# Altium schematic sheet 24V_Main_Regulator.SchDoc (part 3 of 5)
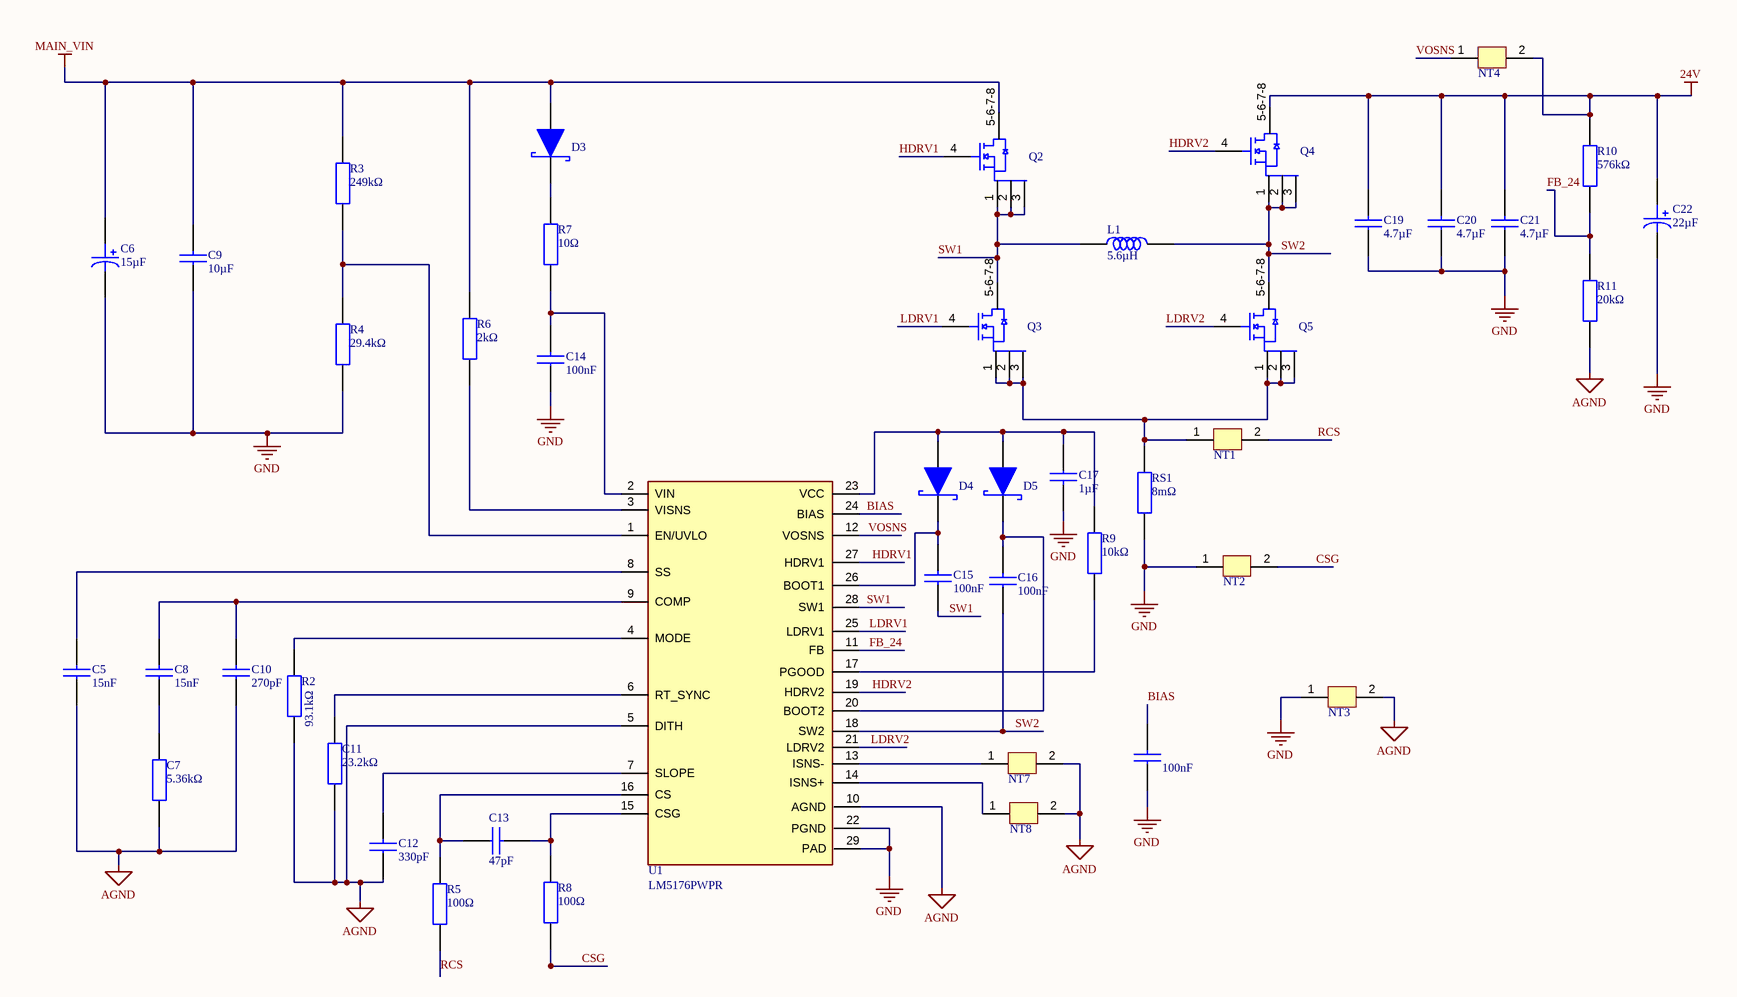
[diagram p2: 24V_Main_Regulator.SchDoc]

## Library data of the parts (continued)
C14 = CC0603KRX7R9BB104: Multilayer Ceramic Capacitor, CC Series, 0.1 - F, - 10%, X7R, 50 V, 0603 [1608 Metric]; Manufacturer: Yageo Group; Voltage: 50V; Supplier: Farnell; Supplier Part Number: CC0603KRX7R9BB104; Manufacturer Part Number: CC0603KRX7R9BB104; RoHS: Compliant; Category: Ceramic Capacitors; Stock: 1056568; Pricing: 10=0,0259, 100=0,0121, 500=0,0113, 1000=0,0104, 2000=0,0089, 4000=0,0073 (EUR); Case/Package: 0603; Case Code (Imperial): 0603; Case Code (Metric): 1608; China RoHS: Compliant; Country of Origin: Mainland China, Taiwan; Depth: 800µm; Dielectric: X7R; Dielectric Material: Ceramic; Export Control Classification Number (ECCN) Code: EAR99; Halogen Free: Halogen Free; Height: 800µm; Harmonized Tariff Schedule (HTS) Code: 8532.24.00.20; Introduction Date: 2005-08-18; Lead Free: Lead Free; Length: 1.6mm; Lifecycle Status: Production; Material: Ceramic; Max Operating Temperature: 125°C; Min Operating Temperature: -55°C; Mounting Technology: Surface Mount; Pins: 2; Number of Terminals: 2; Radiation Hardening: No; REACH SVHC: Yes; Schedule B: 8532240020, 8532240020|8532240020, 8532240020|8532240020|8532240020, 8532240020|8532240020|8532240020|8532240020; Termination: SMD/SMT; Thickness: 889µm; Tolerance: 10%; Voltage Rating: 50V; Voltage Rating (DC): 50V; Width: 800µm; ComponentLink1URL: https://datasheet.octopart.com:443/CC0603KRX7R9BB104-Yageo-datasheet-177165144.pdf?src-supplier=IHS; ComponentLink1Description: https://datasheet.octopart.com:443/CC0603KRX7R9BB104-Yageo-datasheet-177165144.pdf?src-supplier=IHS; ComponentLink2URL: https://datasheet.octopart.com:443/CC0603KRX7R9BB104-Yageo-datasheet-82288757.pdf?src-supplier=Upverter; ComponentLink2Description: https://datasheet.octopart.com:443/CC0603KRX7R9BB104-Yageo-datasheet-82288757.pdf?src-supplier=Upverter; ComponentLink3URL: https://datasheet.octopart.com:443/CC0603KRX7R9BB104-Yageo-datasheet-68298032.pdf?src-supplier=Upverter; ComponentLink3Description: https://datasheet.octopart.com:443/CC0603KRX7R9BB104-Yageo-datasheet-68298032.pdf?src-supplier=Upverter; ComponentLink4URL: https://datasheet.octopart.com:443/CC0603KRX7R9BB104-Yageo-Group-datasheet-189192896.pdf?src-supplier=Future+Electronics; ComponentLink4Description: https://datasheet.octopart.com:443/CC0603KRX7R9BB104-Yageo-Group-datasheet-189192896.pdf?src-supplier=Future+Electronics; ComponentLink5URL: https://datasheet.octopart.com:443/CC0603KRX7R9BB104-Yageo-datasheet-12526321.pdf?src-supplier=Future+Electronics; ComponentLink5Description: https://datasheet.octopart.com:443/CC0603KRX7R9BB104-Yageo-datasheet-12526321.pdf?src-supplier=Future+Electronics; ComponentLink6URL: https://datasheet.octopart.com:443/CC0603KRX7R9BB104-Yageo-datasheet-166511530.pdf?src-supplier=Future+Electronics; ComponentLink6Description: https://datasheet.octopart.com:443/CC0603KRX7R9BB104-Yageo-datasheet-166511530.pdf?src-supplier=Future+Electronics; ComponentLink7URL: https://datasheet.octopart.com:443/CC0603KRX7R9BB104-Yageo-datasheet-137700082.pdf?src-supplier=Future+Electronics; ComponentLink7Description: https://datasheet.octopart.com:443/CC0603KRX7R9BB104-Yageo-datasheet-137700082.pdf?src-supplier=Future+Electronics; ComponentLink8URL: https://datasheet.octopart.com:443/CC0603KRX7R9BB104-Yageo-datasheet-137700084.pdf?src-supplier=Future+Electronics; ComponentLink8Description: https://datasheet.octopart.com:443/CC0603KRX7R9BB104-Yageo-datasheet-137700084.pdf?src-supplier=Future+Electronics; ComponentLink9URL: https://datasheet.octopart.com:443/CC0603KRX7R9BB104-Yageo-datasheet-27626582.pdf?src-supplier=Future+Electronics; ComponentLink9Description: https://datasheet.octopart.com:443/CC0603KRX7R9BB104-Yageo-datasheet-27626582.pdf?src-supplier=Future+Electronics; ComponentLink10URL: https://datasheet.octopart.com:443/CC0603KRX7R9BB104-Yageo-datasheet-15895757.pdf?src-supplier=Future+Electronics; ComponentLink10Description: https://datasheet.octopart.com:443/CC0603KRX7R9BB104-Yageo-datasheet-15895757.pdf?src-supplier=Future+Electronics; ComponentLink11URL: https://datasheet.octopart.com:443/CC0603KRX7R9BB104-Yageo-datasheet-8324192.pdf?src-supplier=Future+Electronics; ComponentLink11Description: https://datasheet.octopart.com:443/CC0603KRX7R9BB104-Yageo-datasheet-8324192.pdf?src-supplier=Future+Electronics; ComponentLink12URL: https://datasheet.octopart.com/CC0603KRX7R9BB104-Yageo-datasheet-10883670.pdf; ComponentLink12Description: https://datasheet.octopart.com/CC0603KRX7R9BB104-Yageo-datasheet-10883670.pdf; ComponentLink13URL: https://datasheet.octopart.com:443/CC0603KRX7R9BB104-Yageo-datasheet-181968726.pdf?src-supplier=Newark; ComponentLink13Description: https://datasheet.octopart.com:443/CC0603KRX7R9BB104-Yageo-datasheet-181968726.pdf?src-supplier=Newark; ComponentLink14URL: https://datasheet.octopart.com:443/CC0603KRX7R9BB104-Yageo-datasheet-499490.pdf?src-supplier=Newark; ComponentLink14Description: https://datasheet.octopart.com:443/CC0603KRX7R9BB104-Yageo-datasheet-499490.pdf?src-supplier=Newark; ComponentLink15URL: https://datasheet.octopart.com:443/CC0603KRX7R9BB104-Yageo-datasheet-62336348.pdf?src-supplier=Newark; ComponentLink15Description: https://datasheet.octopart.com:443/CC0603KRX7R9BB104-Yageo-datasheet-62336348.pdf?src-supplier=Newark; ComponentLink16URL: https://datasheet.octopart.com:443/CC0603KRX7R9BB104-Yageo-datasheet-147453679.pdf?src-supplier=Newark; ComponentLink16Description: https://datasheet.octopart.com:443/CC0603KRX7R9BB104-Yageo-datasheet-147453679.pdf?src-supplier=Newark; ComponentLink17URL: https://datasheet.octopart.com:443/CC0603KRX7R9BB104-Yageo-datasheet-151948686.pdf?src-supplier=Farnell; ComponentLink17Description: https://datasheet.octopart.com:443/CC0603KRX7R9BB104-Yageo-datasheet-151948686.pdf?src-supplier=Farnell; ComponentLink18URL: https://datasheet.octopart.com:443/CC0603KRX7R9BB104-Yageo-datasheet-500777.pdf?src-supplier=Farnell; ComponentLink18Description: https://datasheet.octopart.com:443/CC0603KRX7R9BB104-Yageo-datasheet-500777.pdf?src-supplier=Farnell; ComponentLink19URL: https://datasheet.octopart.com:443/CC0603KRX7R9BB104-Yageo-datasheet-178019014.pdf?src-supplier=Burklin+Elektronik; ComponentLink19Description: https://datasheet.octopart.com:443/CC0603KRX7R9BB104-Yageo-datasheet-178019014.pdf?src-supplier=Burklin+Elektronik; ComponentLink20URL: https://datasheet.octopart.com:443/CC0603KRX7R9BB104-Yageo-Group-datasheet-165992755.pdf?src-supplier=ODG+(Origin+Data+Global); ComponentLink20Description: https://datasheet.octopart.com:443/CC0603KRX7R9BB104-Yageo-Group-datasheet-165992755.pdf?src-supplier=ODG+(Origin+Data+Global); ComponentLink21URL: https://datasheet.octopart.com:443/CC0603KRX7R9BB104-Yageo-datasheet-140260305.pdf?src-supplier=SOS+electronic; ComponentLink21Description: https://datasheet.octopart.com:443/CC0603KRX7R9BB104-Yageo-datasheet-140260305.pdf?src-supplier=SOS+electronic; ComponentLink22URL: https://datasheet.octopart.com:443/CC0603KRX7R9BB104-Yageo-datasheet-120101875.pdf?src-supplier=Megastar; ComponentLink22Description: https://datasheet.octopart.com:443/CC0603KRX7R9BB104-Yageo-datasheet-120101875.pdf?src-supplier=Megastar; ComponentLink23URL: https://datasheet.octopart.com:443/CC0603KRX7R9BB104-Yageo-datasheet-8701427.pdf?src-supplier=element14; ComponentLink23Description: https://datasheet.octopart.com:443/CC0603KRX7R9BB104-Yageo-datasheet-8701427.pdf?src-supplier=element14; ComponentLink24URL: https://datasheet.octopart.com:443/CC0603KRX7R9BB104-Yageo-datasheet-5301394.pdf?src-supplier=element14; ComponentLink24Description: https://datasheet.octopart.com:443/CC0603KRX7R9BB104-Yageo-datasheet-5301394.pdf?src-supplier=element14; ComponentLink25URL: https://datasheet.octopart.com:443/CC0603KRX7R9BB104-Yageo-datasheet-17600895.pdf?src-supplier=TME; ComponentLink25Description: https://datasheet.octopart.com:443/CC0603KRX7R9BB104-Yageo-datasheet-17600895.pdf?src-supplier=TME; ComponentLink26URL: http://sigma.octopart.com:80/15889575/rohs_statement/Yageo-CC0603KRX7R9BB104.pdf?src-supplier=Compliance+Statements; ComponentLink26Description: http://sigma.octopart.com:80/15889575/rohs_statement/Yageo-CC0603KRX7R9BB104.pdf?src-supplier=Compliance+Statements; ComponentLink27URL: http://sigma.octopart.com:80/conflict_mineral_statement/Yageo-company-3.pdf?src-supplier=Compliance+Statements; ComponentLink27Description: http://sigma.octopart.com:80/conflict_mineral_statement/Yageo-company-3.pdf?src-supplier=Compliance+Statements
C15 C16 = 06033C104KAT2A: 0603 100 nF 25 V ±10% Tolerance X7R Surface Mount Multilayer Ceramic Capacitor; Manufacturer: KYOCERA AVX; Voltage: 25V; Supplier: Future Electronics; Supplier Part Number: 06033C104KAT2A; Manufacturer Part Number: 06033C104KAT2A; RoHS: Compliant; Category: Ceramic Capacitors; Stock: 264000; Pricing: 8000=0,0028, 40000=0,0027, 100000=0,0026, 300000=0,0026, 600000=0,0024 (USD); Case/Package: 0603; Case Code (Imperial): 0603; Case Code (Metric): 1608; China RoHS: Compliant; Contact Plating: Tin; Country of Origin: Mainland China, Taiwan; Depth: 810µm; Dielectric: X7R; Dielectric Material: Ceramic; Export Control Classification Number (ECCN) Code: EAR99; Height: 900µm; Harmonized Tariff Schedule (HTS) Code: 8532.24.00.20; Introduction Date: 2003-10-30; Lead Free: Lead Free; Length: 1.6mm; Lifecycle Status: Production; Material: Ceramic; Max Operating Temperature: 125°C; Min Operating Temperature: -55°C; Mounting Technology: Surface Mount; Pins: 2; Number of Terminals: 2; Packaging: Cut Tape; Radiation Hardening: No; REACH SVHC: Yes; Schedule B: 8532240020; Termination: SMD/SMT; Thickness: 889µm; Tolerance: 10%; Voltage Rating: 25V; Voltage Rating (DC): 25V; Width: 810µm; ComponentLink1URL: https://datasheet.octopart.com:443/06033C104KAT2A-KYOCERA-AVX-datasheet-170560559.pdf?src-supplier=IHS; ComponentLink1Description: https://datasheet.octopart.com:443/06033C104KAT2A-KYOCERA-AVX-datasheet-170560559.pdf?src-supplier=IHS; ComponentLink2URL: https://datasheet.octopart.com:443/06033C104KAT2A-KYOCERA-AVX-datasheet-50865067.pdf?src-supplier=Upverter; ComponentLink2Description: https://datasheet.octopart.com:443/06033C104KAT2A-KYOCERA-AVX-datasheet-50865067.pdf?src-supplier=Upverter; ComponentLink3URL: https://sigma.octopart.com:443/147443767/technical_drawing/AVX-06033C104KAT2A.pdf?src-supplier=Upverter; ComponentLink3Description: https://sigma.octopart.com:443/147443767/technical_drawing/AVX-06033C104KAT2A.pdf?src-supplier=Upverter; ComponentLink4URL: https://datasheet.octopart.com:443/06033C104KAT2A-KYOCERA-AVX-datasheet-12587061.pdf?src-supplier=Newark; ComponentLink4Description: https://datasheet.octopart.com:443/06033C104KAT2A-KYOCERA-AVX-datasheet-12587061.pdf?src-supplier=Newark; ComponentLink5URL: https://datasheet.octopart.com:443/06033C104KAT2A-KYOCERA-AVX-datasheet-158983632.pdf?src-supplier=Newark; ComponentLink5Description: https://datasheet.octopart.com:443/06033C104KAT2A-KYOCERA-AVX-datasheet-158983632.pdf?src-supplier=Newark; ComponentLink6URL: https://datasheet.octopart.com:443/06033C104KAT2A-AVX-datasheet-12509786.pdf?src-supplier=Farnell; ComponentLink6Description: https://datasheet.octopart.com:443/06033C104KAT2A-AVX-datasheet-12509786.pdf?src-supplier=Farnell; ComponentLink7URL: https://datasheet.octopart.com:443/06033C104KAT2A-AVX-datasheet-8113618.pdf?src-supplier=Future+Electronics; ComponentLink7Description: https://datasheet.octopart.com:443/06033C104KAT2A-AVX-datasheet-8113618.pdf?src-supplier=Future+Electronics; ComponentLink8URL: https://datasheet.octopart.com:443/06033C104KAT2A-AVX-datasheet-5313617.pdf?src-supplier=Future+Electronics; ComponentLink8Description: https://datasheet.octopart.com:443/06033C104KAT2A-AVX-datasheet-5313617.pdf?src-supplier=Future+Electronics; ComponentLink9URL: https://datasheet.octopart.com:443/06033C104KAT2A-AVX-datasheet-167033.pdf?src-supplier=Future+Electronics; ComponentLink9Description: https://datasheet.octopart.com:443/06033C104KAT2A-AVX-datasheet-167033.pdf?src-supplier=Future+Electronics; ComponentLink10URL: https://datasheet.octopart.com:443/06033C104KAT2A-AVX-datasheet-78690206.pdf?src-supplier=element14+APAC; ComponentLink10Description: https://datasheet.octopart.com:443/06033C104KAT2A-AVX-datasheet-78690206.pdf?src-supplier=element14+APAC; ComponentLink11URL: https://datasheet.octopart.com:443/06033C104KAT2A-KYOCERA-AVX-datasheet-65931687.pdf?src-supplier=element14+APAC; ComponentLink11Description: https://datasheet.octopart.com:443/06033C104KAT2A-KYOCERA-AVX-datasheet-65931687.pdf?src-supplier=element14+APAC; ComponentLink12URL: https://datasheet.octopart.com:443/06033C104KAT2A-AVX-datasheet-26446220.pdf?src-supplier=element14+APAC; ComponentLink12Description: https://datasheet.octopart.com:443/06033C104KAT2A-AVX-datasheet-26446220.pdf?src-supplier=element14+APAC; ComponentLink13URL: https://datasheet.octopart.com:443/06033C104KAT2A-AVX---Kyocera-datasheet-8446237.pdf?src-supplier=TME; ComponentLink13Description: https://datasheet.octopart.com:443/06033C104KAT2A-AVX---Kyocera-datasheet-8446237.pdf?src-supplier=TME; ComponentLink14URL: https://datasheet.octopart.com:443/06033C104KAT2A-KYOCERA-AVX-datasheet-156093841.pdf?src-supplier=TME; ComponentLink14Description: https://datasheet.octopart.com:443/06033C104KAT2A-KYOCERA-AVX-datasheet-156093841.pdf?src-supplier=TME; ComponentLink15URL: https://datasheet.octopart.com:443/06033C104KAT2A-AVX-datasheet-166051239.pdf?src-supplier=Amar+Radio+Corporation; ComponentLink15Description: https://datasheet.octopart.com:443/06033C104KAT2A-AVX-datasheet-166051239.pdf?src-supplier=Amar+Radio+Corporation; ComponentLink16URL: https://datasheet.octopart.com/06033C104KAT2A-AVX---Kyocera-datasheet-13516023.pdf; ComponentLink16Description: https://datasheet.octopart.com/06033C104KAT2A-AVX---Kyocera-datasheet-13516023.pdf; ComponentLink17URL: https://datasheet.octopart.com/Commercial-Surface-Mount-Chips---X7R-Dielectric-AVX-datasheet-family-100.pdf; ComponentLink17Description: https://datasheet.octopart.com/Commercial-Surface-Mount-Chips---X7R-Dielectric-AVX-datasheet-family-100.pdf; ComponentLink18URL: https://datasheet.octopart.com:443/06033C104KAT2A-AVX-datasheet-11546901.pdf?src-supplier=Arrow+Electronics; ComponentLink18Description: https://datasheet.octopart.com:443/06033C104KAT2A-AVX-datasheet-11546901.pdf?src-supplier=Arrow+Electronics; ComponentLink19URL: https://datasheet.octopart.com:443/06033C104KAT2A-AVX-datasheet-8316804.pdf?src-supplier=Garrett; ComponentLink19Description: https://datasheet.octopart.com:443/06033C104KAT2A-AVX-datasheet-8316804.pdf?src-supplier=Garrett; ComponentLink20URL: https://datasheet.octopart.com:443/06033C104KAT2A-AVX-datasheet-5383.pdf?src-supplier=Garrett; ComponentLink20Description: https://datasheet.octopart.com:443/06033C104KAT2A-AVX-datasheet-5383.pdf?src-supplier=Garrett; ComponentLink21URL: https://datasheet.octopart.com:443/06033C104KAT2A-AVX-datasheet-148183.pdf?src-supplier=Garrett; ComponentLink21Description: https://datasheet.octopart.com:443/06033C104KAT2A-AVX-datasheet-148183.pdf?src-supplier=Garrett; ComponentLink22URL: https://datasheet.octopart.com:443/06033C104KAT2A-AVX-datasheet-7276737.pdf?src-supplier=Jameco; ComponentLink22Description: https://datasheet.octopart.com:443/06033C104KAT2A-AVX-datasheet-7276737.pdf?src-supplier=Jameco; ComponentLink23URL: https://datasheet.octopart.com:443/06033C104KAT2A-AVX-datasheet-119053.pdf?src-supplier=DigiKey; ComponentLink23Description: https://datasheet.octopart.com:443/06033C104KAT2A-AVX-datasheet-119053.pdf?src-supplier=DigiKey; ComponentLink24URL: https://datasheet.octopart.com:443/06033C104KAT2A-AVX-datasheet-4352.pdf?src-supplier=RS+(Formerly+Allied+Electronics); ComponentLink24Description: https://datasheet.octopart.com:443/06033C104KAT2A-AVX-datasheet-4352.pdf?src-supplier=RS+(Formerly+Allied+Electronics); ComponentLink25URL: http://sigma.octopart.com:80/conflict_mineral_statement/AVX-company-34.pdf?src-supplier=Compliance+Statements; ComponentLink25Description: http://sigma.octopart.com:80/conflict_mineral_statement/AVX-company-34.pdf?src-supplier=Compliance+Statements; ComponentLink26URL: http://sigma.octopart.com:80/reach_statement/AVX-company-19.pdf?src-supplier=Compliance+Statements; ComponentLink26Description: http://sigma.octopart.com:80/reach_statement/AVX-company-19.pdf?src-supplier=Compliance+Statements
C17 = EMK107B7105KA-T: 16V 1uF X7R ±10% 0603 Multilayer Ceramic Capacitors MLCC - SMD/SMT ROHS; Manufacturer: TAIYO YUDEN; Supplier: Avnet; Supplier Part Number: EMK107B7105KA-T; Manufacturer Part Number: EMK107B7105KA-T; RoHS: Compliant; Category: Ceramic Capacitors; Stock: 1408000; Pricing: 4000=0,00792 (USD); Case/Package: 0603; Case Code (Imperial): 0603; Case Code (Metric): 1608; China RoHS: Compliant; Composition: Ceramic; Contact Plating: Nickel; Country of Origin: Japan, Mainland China, Malaysia, South Korea; Depth: 800µm; Dielectric: X7R; Dielectric Material: Ceramic; Export Control Classification Number (ECCN) Code: EAR99; Halogen Free: Halogen Free; Height: 800µm; Harmonized Tariff Schedule (HTS) Code: 8532.24.00.20; Introduction Date: 2007-09-13; Lead Free: Lead Free; Length: 1.6mm; Lifecycle Status: Production; Material: Ceramic; Max Length: 1.7mm; Max Operating Temperature: 125°C; Max Thickness: 900µm; Max Width: 900µm; Min Length: 1.5mm; Min Operating Temperature: -55°C; Min Thickness: 700µm; Min Width: 700µm; Mounting Technology: Surface Mount; Pins: 2; Number of Terminals: 2; Packaging: Cut Tape; Radiation Hardening: No; REACH SVHC: Yes; Termination: SMD/SMT; Thickness: 889µm; Tolerance: 10%; Voltage Rating: 16V; Voltage Rating (DC): 16V; Width: 800µm; ComponentLink1URL: https://datasheet.octopart.com:443/EMK107B7105KA-T-Taiyo-Yuden-datasheet-182102775.pdf?src-supplier=IHS; ComponentLink1Description: https://datasheet.octopart.com:443/EMK107B7105KA-T-Taiyo-Yuden-datasheet-182102775.pdf?src-supplier=IHS; ComponentLink2URL: https://datasheet.octopart.com:443/EMK107B7105KA-T-Taiyo-Yuden-datasheet-8857305.pdf?src-supplier=Master+Electronics; ComponentLink2Description: https://datasheet.octopart.com:443/EMK107B7105KA-T-Taiyo-Yuden-datasheet-8857305.pdf?src-supplier=Master+Electronics; ComponentLink3URL: https://datasheet.octopart.com:443/EMK107B7105KA-T-Taiyo-Yuden-datasheet-154807686.pdf?src-supplier=Master+Electronics; ComponentLink3Description: https://datasheet.octopart.com:443/EMK107B7105KA-T-Taiyo-Yuden-datasheet-154807686.pdf?src-supplier=Master+Electronics; ComponentLink4URL: https://datasheet.octopart.com:443/EMK107B7105KA-T-Taiyo-Yuden-datasheet-140424376.pdf?src-supplier=Master+Electronics; ComponentLink4Description: https://datasheet.octopart.com:443/EMK107B7105KA-T-Taiyo-Yuden-datasheet-140424376.pdf?src-supplier=Master+Electronics; ComponentLink5URL: https://datasheet.octopart.com:443/EMK107B7105KA-T-Taiyo-Yuden-datasheet-151625811.pdf?src-supplier=Farnell; ComponentLink5Description: https://datasheet.octopart.com:443/EMK107B7105KA-T-Taiyo-Yuden-datasheet-151625811.pdf?src-supplier=Farnell; ComponentLink6URL: https://datasheet.octopart.com:443/EMK107B7105KA-T-Taiyo-Yuden-datasheet-65850851.pdf?src-supplier=Newark; ComponentLink6Description: https://datasheet.octopart.com:443/EMK107B7105KA-T-Taiyo-Yuden-datasheet-65850851.pdf?src-supplier=Newark; ComponentLink7URL: https://datasheet.octopart.com:443/EMK107B7105KA-T-Taiyo-Yuden-datasheet-14717454.pdf?src-supplier=Newark; ComponentLink7Description: https://datasheet.octopart.com:443/EMK107B7105KA-T-Taiyo-Yuden-datasheet-14717454.pdf?src-supplier=Newark; ComponentLink8URL: https://datasheet.octopart.com:443/EMK107B7105KA-T-Taiyo-Yuden-datasheet-138738940.pdf?src-supplier=Taiyo+Yuden+SCT; ComponentLink8Description: https://datasheet.octopart.com:443/EMK107B7105KA-T-Taiyo-Yuden-datasheet-138738940.pdf?src-supplier=Taiyo+Yuden+SCT; ComponentLink9URL: https://datasheet.octopart.com:443/EMK107B7105KA-T-Taiyo-Yuden-datasheet-99784766.pdf?src-supplier=Future+Electronics; ComponentLink9Description: https://datasheet.octopart.com:443/EMK107B7105KA-T-Taiyo-Yuden-datasheet-99784766.pdf?src-supplier=Future+Electronics; ComponentLink10URL: https://datasheet.octopart.com:443/EMK107B7105KA-T-Taiyo-Yuden-datasheet-99833418.pdf?src-supplier=Future+Electronics; ComponentLink10Description: https://datasheet.octopart.com:443/EMK107B7105KA-T-Taiyo-Yuden-datasheet-99833418.pdf?src-supplier=Future+Electronics; ComponentLink11URL: https://datasheet.octopart.com:443/CEEMK107B7105KA-T-Taiyo-Yuden-datasheet-62282700.pdf?src-supplier=Electro+Sonic; ComponentLink11Description: https://datasheet.octopart.com:443/CEEMK107B7105KA-T-Taiyo-Yuden-datasheet-62282700.pdf?src-supplier=Electro+Sonic; ComponentLink12URL: https://datasheet.octopart.com:443/EMK107B7105KA-T-Taiyo-Yuden-datasheet-62109223.pdf?src-supplier=Electro+Sonic; ComponentLink12Description: https://datasheet.octopart.com:443/EMK107B7105KA-T-Taiyo-Yuden-datasheet-62109223.pdf?src-supplier=Electro+Sonic; ComponentLink13URL: https://datasheet.octopart.com:443/EMK107B7105KA-T-Taiyo-Yuden-datasheet-41181424.pdf?src-supplier=Electro+Sonic; ComponentLink13Description: https://datasheet.octopart.com:443/EMK107B7105KA-T-Taiyo-Yuden-datasheet-41181424.pdf?src-supplier=Electro+Sonic; ComponentLink14URL: https://datasheet.octopart.com/EMK107B7105KA-T-Taiyo-Yuden-datasheet-17272276.pdf; ComponentLink14Description: https://datasheet.octopart.com/EMK107B7105KA-T-Taiyo-Yuden-datasheet-17272276.pdf; ComponentLink15URL: https://datasheet.octopart.com:443/EMK107B7105KA-T-Taiyo-Yuden-datasheet-13693549.pdf?src-supplier=_legacy+Avnet; ComponentLink15Description: https://datasheet.octopart.com:443/EMK107B7105KA-T-Taiyo-Yuden-datasheet-13693549.pdf?src-supplier=_legacy+Avnet; ComponentLink16URL: https://datasheet.octopart.com:443/EMK107B7105KA-T-Taiyo-Yuden-datasheet-10851928.pdf?src-supplier=element14; ComponentLink16Description: https://datasheet.octopart.com:443/EMK107B7105KA-T-Taiyo-Yuden-datasheet-10851928.pdf?src-supplier=element14; ComponentLink17URL: https://datasheet.octopart.com:443/EMK107B7105KA-T-Taiyo-Yuden-datasheet-8434558.pdf?src-supplier=element14; ComponentLink17Description: https://datasheet.octopart.com:443/EMK107B7105KA-T-Taiyo-Yuden-datasheet-8434558.pdf?src-supplier=element14; ComponentLink18URL: https://datasheet.octopart.com:443/EMK107B7105KA-T-Taiyo-Yuden-datasheet-10742123.pdf?src-supplier=Factory+Futures; ComponentLink18Description: https://datasheet.octopart.com:443/EMK107B7105KA-T-Taiyo-Yuden-datasheet-10742123.pdf?src-supplier=Factory+Futures
C18 = C0805C104M5RACTU: 50V 100nF X7R ±20% 0805 Multilayer Ceramic Capacitors MLCC - SMD/SMT ROHS; Manufacturer: Yageo Group; Dissipation Factor: 2.5%; Temperature Coefficient: 30ppm/°C; Supplier: Farnell; Supplier Part Number: C0805C104M5RACTU; Manufacturer Part Number: C0805C104M5RACTU; RoHS: Compliant; Category: Ceramic Capacitors; Stock: 81750; Pricing: 10=0,0284, 100=0,0246, 500=0,0179, 1000=0,0161, 2000=0,0135 (EUR); Case/Package: 0805; Case Code (Imperial): 0805; China RoHS: Compliant; Country of Origin: Mexico; Depth: 1.25mm; Dielectric: X7R; Dielectric Material: Ceramic; Export Control Classification Number (ECCN) Code: EAR99; Height: 780µm; Harmonized Tariff Schedule (HTS) Code: 8532.24.00.20; Introduction Date: 2008-01-10; Lead Free: Lead Free; Length: 2mm; Lifecycle Status: Production; Material: Ceramic; Max Operating Temperature: 125°C; Min Operating Temperature: -55°C; Mounting Technology: Surface Mount; Pins: 2; Number of Terminals: 2; Packaging: Cut Tape; Radiation Hardening: No; REACH SVHC: Yes; Schedule B: 8532240020, 8532240020|8532240020, 8532240020|8532240020|8532240020, 8532240020|8532240020|8532240020|8532240020; Termination: SMD/SMT; Thickness: 889µm; Tolerance: 20%; Voltage: 50V; Voltage Rating: 50V; Voltage Rating (DC): 50V; Weight: 5.499807mg; Width: 1.25mm; ComponentLink1URL: https://datasheet.octopart.com:443/C0805C104M5RACTU-KEMET-datasheet-178445679.pdf?src-supplier=Farnell; ComponentLink1Description: https://datasheet.octopart.com:443/C0805C104M5RACTU-KEMET-datasheet-178445679.pdf?src-supplier=Farnell; ComponentLink2URL: https://datasheet.octopart.com:443/C0805C104M5RACTU-KEMET-datasheet-137357759.pdf?src-supplier=Farnell; ComponentLink2Description: https://datasheet.octopart.com:443/C0805C104M5RACTU-KEMET-datasheet-137357759.pdf?src-supplier=Farnell; ComponentLink3URL: https://datasheet.octopart.com:443/C0805C104M5RACTU-KEMET-datasheet-101576149.pdf?src-supplier=Farnell; ComponentLink3Description: https://datasheet.octopart.com:443/C0805C104M5RACTU-KEMET-datasheet-101576149.pdf?src-supplier=Farnell; ComponentLink4URL: https://datasheet.octopart.com:443/C0805C104M5RAC-TU-Kemet-datasheet-7833651.pdf?src-supplier=Farnell; ComponentLink4Description: https://datasheet.octopart.com:443/C0805C104M5RAC-TU-Kemet-datasheet-7833651.pdf?src-supplier=Farnell; ComponentLink5URL: https://datasheet.octopart.com:443/C0805C104M5RAC-TU-Kemet-datasheet-7601896.pdf?src-supplier=Farnell; ComponentLink5Description: https://datasheet.octopart.com:443/C0805C104M5RAC-TU-Kemet-datasheet-7601896.pdf?src-supplier=Farnell; ComponentLink6URL: https://datasheet.octopart.com:443/C0805C104M5RAC-TU-Kemet-datasheet-5316294.pdf?src-supplier=Farnell; ComponentLink6Description: https://datasheet.octopart.com:443/C0805C104M5RAC-TU-Kemet-datasheet-5316294.pdf?src-supplier=Farnell; ComponentLink7URL: https://datasheet.octopart.com:443/C0805C104M5RAC-TU-Kemet-datasheet-5314837.pdf?src-supplier=Farnell; ComponentLink7Description: https://datasheet.octopart.com:443/C0805C104M5RAC-TU-Kemet-datasheet-5314837.pdf?src-supplier=Farnell; ComponentLink8URL: https://datasheet.octopart.com:443/C0805C104M5RAC-TU-Kemet-datasheet-8092359.pdf?src-supplier=Farnell; ComponentLink8Description: https://datasheet.octopart.com:443/C0805C104M5RAC-TU-Kemet-datasheet-8092359.pdf?src-supplier=Farnell; ComponentLink9URL: https://datasheet.octopart.com:443/C0805C104M5RAC-TU-Kemet-datasheet-5314449.pdf?src-supplier=Farnell; ComponentLink9Description: https://datasheet.octopart.com:443/C0805C104M5RAC-TU-Kemet-datasheet-5314449.pdf?src-supplier=Farnell; ComponentLink10URL: https://datasheet.octopart.com:443/C0805C104M5RAC-TU-Kemet-datasheet-5314969.pdf?src-supplier=Farnell; ComponentLink10Description: https://datasheet.octopart.com:443/C0805C104M5RAC-TU-Kemet-datasheet-5314969.pdf?src-supplier=Farnell; ComponentLink11URL: https://datasheet.octopart.com:443/C0805C104M5RAC-TU-Kemet-datasheet-5314627.pdf?src-supplier=Farnell; ComponentLink11Description: https://datasheet.octopart.com:443/C0805C104M5RAC-TU-Kemet-datasheet-5314627.pdf?src-supplier=Farnell; ComponentLink12URL: https://datasheet.octopart.com:443/C0805C104M5RAC-TU-Kemet-datasheet-5389132.pdf?src-supplier=Farnell; ComponentLink12Description: https://datasheet.octopart.com:443/C0805C104M5RAC-TU-Kemet-datasheet-5389132.pdf?src-supplier=Farnell; ComponentLink13URL: https://datasheet.octopart.com:443/C0805C104M5RAC-TU-Kemet-datasheet-5313836.pdf?src-supplier=Farnell; ComponentLink13Description: https://datasheet.octopart.com:443/C0805C104M5RAC-TU-Kemet-datasheet-5313836.pdf?src-supplier=Farnell; ComponentLink14URL: https://datasheet.octopart.com:443/C0805C104M5RAC-TU-Kemet-datasheet-8111010.pdf?src-supplier=Farnell; ComponentLink14Description: https://datasheet.octopart.com:443/C0805C104M5RAC-TU-Kemet-datasheet-8111010.pdf?src-supplier=Farnell; ComponentLink15URL: https://datasheet.octopart.com:443/C0805C104M5RAC-TU-Kemet-datasheet-7627733.pdf?src-supplier=Farnell; ComponentLink15Description: https://datasheet.octopart.com:443/C0805C104M5RAC-TU-Kemet-datasheet-7627733.pdf?src-supplier=Farnell; ComponentLink16URL: https://datasheet.octopart.com:443/C0805C104M5RAC-TU-Kemet-datasheet-5315946.pdf?src-supplier=Farnell; ComponentLink16Description: https://datasheet.octopart.com:443/C0805C104M5RAC-TU-Kemet-datasheet-5315946.pdf?src-supplier=Farnell; ComponentLink17URL: https://datasheet.octopart.com:443/C0805C104M5RACTU-KEMET-datasheet-182041143.pdf?src-supplier=IHS; ComponentLink17Description: https://datasheet.octopart.com:443/C0805C104M5RACTU-KEMET-datasheet-182041143.pdf?src-supplier=IHS; ComponentLink18URL: https://datasheet.octopart.com:443/C0805C104M5RACTU-KEMET-datasheet-68331921.pdf?src-supplier=Upverter; ComponentLink18Description: https://datasheet.octopart.com:443/C0805C104M5RACTU-KEMET-datasheet-68331921.pdf?src-supplier=Upverter; ComponentLink19URL: https://datasheet.octopart.com:443/C0805C104M5RAC-TU-Kemet-datasheet-5313890.pdf?src-supplier=Newark; ComponentLink19Description: https://datasheet.octopart.com:443/C0805C104M5RAC-TU-Kemet-datasheet-5313890.pdf?src-supplier=Newark; ComponentLink20URL: https://datasheet.octopart.com:443/C0805C104M5RAC-TU-Kemet-datasheet-5390537.pdf?src-supplier=Newark; ComponentLink20Description: https://datasheet.octopart.com:443/C0805C104M5RAC-TU-Kemet-datasheet-5390537.pdf?src-supplier=Newark; ComponentLink21URL: https://datasheet.octopart.com:443/C0805C104M5RAC-TU-Kemet-datasheet-7541751.pdf?src-supplier=Newark; ComponentLink21Description: https://datasheet.octopart.com:443/C0805C104M5RAC-TU-Kemet-datasheet-7541751.pdf?src-supplier=Newark; ComponentLink22URL: https://datasheet.octopart.com:443/C0805C104M5RACTU-KEMET-datasheet-176289591.pdf?src-supplier=Newark; ComponentLink22Description: https://datasheet.octopart.com:443/C0805C104M5RACTU-KEMET-datasheet-176289591.pdf?src-supplier=Newark; ComponentLink23URL: https://datasheet.octopart.com:443/C0805C104M5RACTU-KEMET-datasheet-130256537.pdf?src-supplier=Newark; ComponentLink23Description: https://datasheet.octopart.com:443/C0805C104M5RACTU-KEMET-datasheet-130256537.pdf?src-supplier=Newark; ComponentLink24URL: https://datasheet.octopart.com:443/C0805C104M5RACTU-Kemet-datasheet-27203261.pdf?src-supplier=Newark; ComponentLink24Description: https://datasheet.octopart.com:443/C0805C104M5RACTU-Kemet-datasheet-27203261.pdf?src-supplier=Newark; ComponentLink25URL: https://datasheet.octopart.com:443/C0805C104M5RACTU-Kemet-datasheet-8764837.pdf?src-supplier=Newark; ComponentLink25Description: https://datasheet.octopart.com:443/C0805C104M5RACTU-Kemet-datasheet-8764837.pdf?src-supplier=Newark; ComponentLink26URL: https://datasheet.octopart.com:443/C0805C104M5RACTU-Kemet-datasheet-8480123.pdf?src-supplier=Newark; ComponentLink26Description: https://datasheet.octopart.com:443/C0805C104M5RACTU-Kemet-datasheet-8480123.pdf?src-supplier=Newark; ComponentLink27URL: https://datasheet.octopart.com:443/C0805C104M5RACTU-Kemet-datasheet-5393970.pdf?src-supplier=Newark; ComponentLink27Description: https://datasheet.octopart.com:443/C0805C104M5RACTU-Kemet-datasheet-5393970.pdf?src-supplier=Newark; ComponentLink28URL: https://datasheet.octopart.com:443/C0805C104M5RACTU-Kemet-datasheet-8502025.pdf?src-supplier=Newark; ComponentLink28Description: https://datasheet.octopart.com:443/C0805C104M5RACTU-Kemet-datasheet-8502025.pdf?src-supplier=Newark; ComponentLink29URL: https://datasheet.octopart.com:443/C0805C104M5RACTU-Kemet-datasheet-161801.pdf?src-supplier=Newark; ComponentLink29Description: https://datasheet.octopart.com:443/C0805C104M5RACTU-Kemet-datasheet-161801.pdf?src-supplier=Newark; ComponentLink30URL: https://datasheet.octopart.com:443/C0805C104M5RACTU-KEMET-datasheet-37550250.pdf?src-supplier=Electro+Sonic; ComponentLink30Description: https://datasheet.octopart.com:443/C0805C104M5RACTU-KEMET-datasheet-37550250.pdf?src-supplier=Electro+Sonic; ComponentLink31URL: https://datasheet.octopart.com:443/C0805C104M5RACTU-Kemet-datasheet-12608295.pdf?src-supplier=element14+APAC; ComponentLink31Description: https://datasheet.octopart.com:443/C0805C104M5RACTU-Kemet-datasheet-12608295.pdf?src-supplier=element14+APAC; ComponentLink32URL: https://datasheet.octopart.com:443/C0805C104M5RACTU-Kemet-datasheet-11992184.pdf?src-supplier=element14+APAC; ComponentLink32Description: https://datasheet.octopart.com:443/C0805C104M5RACTU-Kemet-datasheet-11992184.pdf?src-supplier=element14+APAC; ComponentLink33URL: https://datasheet.octopart.com:443/C0805C104M5RACTU-Kemet-datasheet-10942409.pdf?src-supplier=element14+APAC; ComponentLink33Description: https://datasheet.octopart.com:443/C0805C104M5RACTU-Kemet-datasheet-10942409.pdf?src-supplier=element14+APAC; ComponentLink34URL: https://datasheet.octopart.com:443/C0805C104M5RACTU-Kemet-datasheet-10404442.pdf?src-supplier=element14+APAC; ComponentLink34Description: https://datasheet.octopart.com:443/C0805C104M5RACTU-Kemet-datasheet-10404442.pdf?src-supplier=element14+APAC; ComponentLink35URL: https://datasheet.octopart.com:443/C0805C104M5RACTU-Kemet-datasheet-66534773.pdf?src-supplier=element14+APAC; ComponentLink35Description: https://datasheet.octopart.com:443/C0805C104M5RACTU-Kemet-datasheet-66534773.pdf?src-supplier=element14+APAC; ComponentLink36URL: https://datasheet.octopart.com:443/C0805C104M5RACTU-Kemet-datasheet-66100808.pdf?src-supplier=element14+APAC; ComponentLink36Description: https://datasheet.octopart.com:443/C0805C104M5RACTU-Kemet-datasheet-66100808.pdf?src-supplier=element14+APAC; ComponentLink37URL: https://datasheet.octopart.com:443/C0805C104M5RACTU-Kemet-datasheet-32036385.pdf?src-supplier=element14+APAC; ComponentLink37Description: https://datasheet.octopart.com:443/C0805C104M5RACTU-Kemet-datasheet-32036385.pdf?src-supplier=element14+APAC; ComponentLink38URL: https://datasheet.octopart.com:443/C0805C104M5RAC7800-KEMET-datasheet-188512054.pdf?src-supplier=ODG+(Origin+Data+Global); ComponentLink38Description: https://datasheet.octopart.com:443/C0805C104M5RAC7800-KEMET-datasheet-188512054.pdf?src-supplier=ODG+(Origin+Data+Global); ComponentLink39URL: https://datasheet.octopart.com:443/C0805C104M5RACTU-KEMET-datasheet-164512540.pdf?src-supplier=TME; ComponentLink39Description: https://datasheet.octopart.com:443/C0805C104M5RACTU-KEMET-datasheet-164512540.pdf?src-supplier=TME; ComponentLink40URL: https://datasheet.octopart.com:443/C0805C104M5RACTU-Kemet-datasheet-67847108.pdf?src-supplier=TME; ComponentLink40Description: https://datasheet.octopart.com:443/C0805C104M5RACTU-Kemet-datasheet-67847108.pdf?src-supplier=TME; ComponentLink41URL: https://datasheet.octopart.com:443/C0805C104M5RACTU-KEMET-datasheet-68331906.pdf?src-supplier=TME; ComponentLink41Description: https://datasheet.octopart.com:443/C0805C104M5RACTU-KEMET-datasheet-68331906.pdf?src-supplier=TME; ComponentLink42URL: https://datasheet.octopart.com:443/C0805C104M5RACTU-KEMET-datasheet-110724412.pdf?src-supplier=RS+(Formerly+Allied+Electronics); ComponentLink42Description: https://datasheet.octopart.com:443/C0805C104M5RACTU-KEMET-datasheet-110724412.pdf?src-supplier=RS+(Formerly+Allied+Electronics); ComponentLink43URL: https://datasheet.octopart.com:443/C0805C104M5RACTU-Kemet-datasheet-464.pdf?src-supplier=RS+(Formerly+Allied+Electronics); ComponentLink43Description: https://datasheet.octopart.com:443/C0805C104M5RACTU-Kemet-datasheet-464.pdf?src-supplier=RS+(Formerly+Allied+Electronics); ComponentLink44URL: https://datasheet.octopart.com/C0805C104M5RACTU-KEMET-datasheet-84169754.pdf; ComponentLink44Description: https://datasheet.octopart.com/C0805C104M5RACTU-KEMET-datasheet-84169754.pdf; ComponentLink45URL: https://datasheet.octopart.com:443/C0805C104M5RACTU-Kemet-datasheet-11629161.pdf?src-supplier=Arrow+Electronics; ComponentLink45Description: https://datasheet.octopart.com:443/C0805C104M5RACTU-Kemet-datasheet-11629161.pdf?src-supplier=Arrow+Electronics; ComponentLink46URL: https://datasheet.octopart.com:443/C0805C104M5RAC-TU-Kemet-datasheet-7281245.pdf?src-supplier=Jameco; ComponentLink46Description: https://datasheet.octopart.com:443/C0805C104M5RAC-TU-Kemet-datasheet-7281245.pdf?src-supplier=Jameco; ComponentLink47URL: http://sigma.octopart.com:80/conflict_mineral_statement/Yageo-company-3.pdf?src-supplier=Compliance+Statements; ComponentLink47Description: http://sigma.octopart.com:80/conflict_mineral_statement/Yageo-company-3.pdf?src-supplier=Compliance+Statements; ComponentLink48URL: http://sigma.octopart.com:80/rohs_statement/Yageo-company-2.pdf?src-supplier=Compliance+Statements; ComponentLink48Description: http://sigma.octopart.com:80/rohs_statement/Yageo-company-2.pdf?src-supplier=Compliance+Statements
C19-C21 = MSASU21GBB5475KTNA01: Ceramic Capacitor, Multilayer, Ceramic, 50V, 10% +Tol, 10% -Tol, X5R, 15% TC, 4.7uF, Surface Mount, 0805; Manufacturer: TAIYO YUDEN; Supplier: Avnet; Supplier Part Number: MSASU21GBB5475KTNA01; Manufacturer Part Number: MSASU21GBB5475KTNA01; RoHS: Compliant; Category: Ceramic Capacitors; Pricing: 3000=0,06229, 30000=0,05448, 300000=0,05335, 1800000=0,05308, 3600000=0,0528 (USD); Case/Package: 0805; Dielectric Material: Ceramic; Height: 1.25mm; Length: 2mm; Lifecycle Status: Production; Max Operating Temperature: 85°C; Min Operating Temperature: -55°C; Mounting Technology: Surface Mount; Number of Terminals: 2; REACH SVHC: Yes; Voltage Rating (DC): 50V; Width: 1.25mm; ComponentLink1URL: https://datasheet.octopart.com:443/MSASU21GBB5475KTNA01-Taiyo-Yuden-datasheet-182126628.pdf?src-supplier=IHS; ComponentLink1Description: https://datasheet.octopart.com:443/MSASU21GBB5475KTNA01-Taiyo-Yuden-datasheet-182126628.pdf?src-supplier=IHS
C22 = 35SVPF22M: Capacitor, Aluminum Electrolytic, Solid Polymer, Polarized, 35V, 22Uf, Surface Mount, 2626; Manufacturer: Panasonic; Manufacturer Lifecycle Status: ACTIVE; Part Series: SVPF; Dissipation Factor: 12%; ESR (Equivalent Series Resistance): 35mΩ; Leakage Current: 154µA; Life (Hours): 5000hours; Polarity: Polar; Ripple Current: 130mA; Ripple Current (AC): 2.6A; Tolerance: 20%; Supplier: Farnell; Supplier Part Number: 35SVPF22M; Manufacturer Part Number: 35SVPF22M; RoHS: Compliant; Category: Aluminum Electrolytic Capacitors; Stock: 875; Pricing: 1=1,32, 50=0,872, 100=0,78, 250=0,73, 500=0,679 (EUR); Case/Package: Radial; Country of Origin: Japan; Diameter: 6.3mm; Export Control Classification Number (ECCN) Code: EAR99; Height: 5.9mm; Height - Seated (Max): 5.9944mm; Introduction Date: 2013-06-17; Length: 6.6mm; Lifecycle Status: Production; Material: Polymer; Max Operating Temperature: 105°C; Min Operating Temperature: -55°C; Mounting Technology: Surface Mount; Pins: 6; Number of Terminals: 2; REACH SVHC: Yes; Schedule B: 8532220020, 8532220020|8532220020|8532220020|8532220020|8532220020; Termination: SMD/SMT; Voltage: 35V; Voltage Rating: 35V; Voltage Rating (DC): 35V; Width: 6.6mm; ComponentLink1URL: https://datasheet.octopart.com:443/35SVPF22M-Panasonic-datasheet-61627574.pdf?src-supplier=element14+APAC; ComponentLink1Description: https://datasheet.octopart.com:443/35SVPF22M-Panasonic-datasheet-61627574.pdf?src-supplier=element14+APAC; ComponentLink2URL: https://datasheet.octopart.com:443/35SVPF22M-Panasonic-datasheet-182100667.pdf?src-supplier=IHS; ComponentLink2Description: https://datasheet.octopart.com:443/35SVPF22M-Panasonic-datasheet-182100667.pdf?src-supplier=IHS; ComponentLink3URL: https://sigma.octopart.com:443/138897373/technical_drawing/Panasonic-35SVPF22M.pdf?src-supplier=Upverter; ComponentLink3Description: https://sigma.octopart.com:443/138897373/technical_drawing/Panasonic-35SVPF22M.pdf?src-supplier=Upverter; ComponentLink4URL: https://datasheet.octopart.com:443/35SVPF22M-Panasonic-datasheet-137287092.pdf?src-supplier=TME; ComponentLink4Description: https://datasheet.octopart.com:443/35SVPF22M-Panasonic-datasheet-137287092.pdf?src-supplier=TME; ComponentLink5URL: https://datasheet.octopart.com:443/35SVPF22M-Panasonic-datasheet-154766060.pdf?src-supplier=Master+Electronics; ComponentLink5Description: https://datasheet.octopart.com:443/35SVPF22M-Panasonic-datasheet-154766060.pdf?src-supplier=Master+Electronics; ComponentLink6URL: https://sigma.octopart.com:443/150570690/technical_drawing/Panasonic-35SVPF22M.pdf?src-supplier=Panasonic+SCT; ComponentLink6Description: https://sigma.octopart.com:443/150570690/technical_drawing/Panasonic-35SVPF22M.pdf?src-supplier=Panasonic+SCT; ComponentLink7URL: https://datasheet.octopart.com:443/35SVPF22M-Panasonic-datasheet-17853225.pdf?src-supplier=Farnell; ComponentLink7Description: https://datasheet.octopart.com:443/35SVPF22M-Panasonic-datasheet-17853225.pdf?src-supplier=Farnell; ComponentLink8URL: https://datasheet.octopart.com:443/35SVPF22M-Panasonic-datasheet-17932128.pdf?src-supplier=Farnell; ComponentLink8Description: https://datasheet.octopart.com:443/35SVPF22M-Panasonic-datasheet-17932128.pdf?src-supplier=Farnell; ComponentLink9URL: https://datasheet.octopart.com:443/35SVPF22M-Panasonic-datasheet-41466111.pdf?src-supplier=RS+(Formerly+Allied+Electronics); ComponentLink9Description: https://datasheet.octopart.com:443/35SVPF22M-Panasonic-datasheet-41466111.pdf?src-supplier=RS+(Formerly+Allied+Electronics)
D3-D5 = SS110: Rectifier Diode, Schottky, 1 Phase, 1 Element, 1A, 100V V(RRM), Silicon; Manufacturer: Taiwan Semiconductor; Manufacturer Lifecycle Status: ACTIVE; Forward Voltage: 800mV; Max Forward Surge Current (Ifsm): 40A; Max Junction Temperature (Tj): 150°C; Max Reverse Leakage Current: 100µA; Number of Elements: 1; Power Dissipation: 400mW; Reverse Recovery Time: 25ns; Supplier: Farnell; Supplier Part Number: SS110; Manufacturer Part Number: SS110; RoHS: Compliant; Category: Schottky Diodes; Stock: 13064; Pricing: 5=0,296, 10=0,19, 100=0,124, 500=0,0917, 1000=0,0726, 5000=0,064 (EUR); Case/Package: SMD/SMT; China RoHS: Non-Compliant; Contact Plating: Tin; Country of Origin: Mainland China, Taiwan; Export Control Classification Number (ECCN) Code: EAR99; Forward Current: 1A; Harmonized Tariff Schedule (HTS) Code: 8541.10.00.80; Introduction Date: 1998-08-01; Lifecycle Status: Production; Max Operating Temperature: 150°C; Max Output current: 1A; Max Repetitive Reverse Voltage (Vrrm): 100V; Min Breakdown Voltage: 100V; Min Operating Temperature: -65°C; Number of Terminals: 2; Packaging: Cut Tape; Peak Reverse Current: 100µA; REACH SVHC: No; Reverse Standoff Voltage: 100V; ComponentLink1URL: https://datasheet.octopart.com:443/SS110-Taiwan-Semiconductor-datasheet-179284502.pdf?src-supplier=IHS; ComponentLink1Description: https://datasheet.octopart.com:443/SS110-Taiwan-Semiconductor-datasheet-179284502.pdf?src-supplier=IHS; ComponentLink2URL: https://datasheet.octopart.com:443/SS110-Taiwan-Semiconductor-datasheet-181551144.pdf?src-supplier=IHS; ComponentLink2Description: https://datasheet.octopart.com:443/SS110-Taiwan-Semiconductor-datasheet-181551144.pdf?src-supplier=IHS; ComponentLink3URL: https://datasheet.octopart.com:443/SS110-Taiwan-Semiconductor-datasheet-180789182.pdf?src-supplier=IHS; ComponentLink3Description: https://datasheet.octopart.com:443/SS110-Taiwan-Semiconductor-datasheet-180789182.pdf?src-supplier=IHS; ComponentLink4URL: https://datasheet.octopart.com:443/SS110-Taiwan-Semiconductor-datasheet-68472387.pdf?src-supplier=Taiwan+Semiconductor; ComponentLink4Description: https://datasheet.octopart.com:443/SS110-Taiwan-Semiconductor-datasheet-68472387.pdf?src-supplier=Taiwan+Semiconductor; ComponentLink5URL: https://datasheet.octopart.com:443/SS110-Taiwan-Semiconductor-datasheet-34355587.pdf?src-supplier=Taiwan+Semiconductor; ComponentLink5Description: https://datasheet.octopart.com:443/SS110-Taiwan-Semiconductor-datasheet-34355587.pdf?src-supplier=Taiwan+Semiconductor; ComponentLink6URL: https://datasheet.octopart.com:443/SS110-Taiwan-Semiconductor-datasheet-152739498.pdf?src-supplier=ODG+(Origin+Data+Global); ComponentLink6Description: https://datasheet.octopart.com:443/SS110-Taiwan-Semiconductor-datasheet-152739498.pdf?src-supplier=ODG+(Origin+Data+Global); ComponentLink7URL: https://datasheet.octopart.com:443/SS110-Taiwan-Semiconductor-datasheet-13727340.pdf?src-supplier=Farnell; ComponentLink7Description: https://datasheet.octopart.com:443/SS110-Taiwan-Semiconductor-datasheet-13727340.pdf?src-supplier=Farnell; ComponentLink8URL: https://datasheet.octopart.com:443/SS110-Taiwan-Semiconductor-datasheet-510275.pdf?src-supplier=Newark; ComponentLink8Description: https://datasheet.octopart.com:443/SS110-Taiwan-Semiconductor-datasheet-510275.pdf?src-supplier=Newark
L1 = XAL1010-562MEB: General Purpose Inductor, 5.6uH, 20%, 1 Element, Composite-Core, SMD, 4539; Manufacturer: Coilcraft; DC Resistance (DCR): 6.93mΩ; Max Current Rating: 21.2A; Number of Circuits: 1; Self Resonant Frequency: 16MHz; Shielding: Shielded; Test Frequency: 1MHz; Category: Fixed Inductors; Core Material: Composite; Country of Origin: Mainland China; Export Control Classification Number (ECCN) Code: EAR99; Harmonized Tariff Schedule (HTS) Code: 8504.50.80.00; Height: 10mm; Introduction Date: 2010-10-18; Lead Free: Contains Lead; Length: 11.3mm; Lifecycle Status: Obsolete; LTB Date: 2021-03-01; LTD Date: 2021-03-01; Manufacturer Part Number: XAL1010-562MEB; Max DC Current: 21.2A; Max Operating Temperature: 125°C; Min Operating Temperature: -40°C; Number of Terminals: 2; Ratings: AEC-Q200; REACH SVHC: Yes; RoHS: Compliant; Termination: SMD/SMT; Tolerance: 20%; Width: 10mm; DataSheet: https://eu.mouser.com/datasheet/3/995/1/xal1010.pdf; Supplier: Mouser
Q2 Q3 = CSD19534Q5A: 100-V, N channel NexFET™ power MOSFET, single SON 5 mm x 6 mm, 15.1 mOhm 8-VSONP -55 to 150; Manufacturer: Texas Instruments; Manufacturer Lifecycle Status: ACTIVE; Continuous Drain Current (ID): 10A; Drain to Source Breakdown Voltage: 100V; Drain to Source Resistance: 12.6mΩ; Fall Time: 6ns; Gate to Source Voltage (Vgs): 20V; Input Capacitance: 1.68nF; Max Junction Temperature (Tj): 150°C; Max Power Dissipation: 3.2W; Number of Channels: 1; Rds On Max: 15.1mΩ; Rise Time: 14ns; Turn-Off Delay Time: 20ns; Turn-On Delay Time: 9ns; Supplier: Arrow Electronics; Supplier Part Number: CSD19534Q5A; Manufacturer Part Number: CSD19534Q5A; RoHS: Compliant; Category: MOSFETs; Pricing: 2500=0,3513, 5000=0,3438 (USD); Contact Plating: Tin; Drain to Source Voltage (Vdss): 100V; Element Configuration: Single; Height: 1.1mm; Lead Free: Contains Lead; Length: 4.9mm; Lifecycle Status: Production; Max Operating Temperature: 150°C; Min Operating Temperature: -55°C; Mounting Technology: Surface Mount; Pins: 8; Packaging: Tape & Reel (TR); Power Dissipation: 3.2W; Schedule B: 8541290080, 8541290080|8541290080|8541290080|8541290080|8541290080; Thickness: 1mm; Width: 6mm; ComponentLink1URL: https://sigma.octopart.com:443/184372194/technical_drawing/Texas-Instruments-CSD19534Q5A.pdf?src-supplier=Texas+Instruments; ComponentLink1Description: https://sigma.octopart.com:443/184372194/technical_drawing/Texas-Instruments-CSD19534Q5A.pdf?src-supplier=Texas+Instruments; ComponentLink2URL: https://octopart.com:443/opatz8j6/c1?t=SSdhDRwUEWccND8BYLrNj5wD1DjtHCJGpPp5qL4eDQ_gKDkqciQPO5ZgVlRSX3tJETDLPepYZu7qB-RWFbr__4iawFYiX1x0f3L0zYoZy4CUlTc3azSR3e1lnSN8-jfdVdH1s6CMhBb3JPIXtzs8hm8jvaRxQoLGESKQubNtZgDwPXHZ0ZsYo1Ep0h1d3sd73Ka2YfZZK1yMAljyxNHUS4SSJhdwFE68WOjR8hdkuIs9zH66t5n-H9ix6Idip7XAYAIlOq6p1bYOe5C17hXZrhV6jUGn-XkOCR2RMWOIjiP4mcxejeseXVJw8OcjsJNqLjLvba7cbmD2d5NfNFgZRpXJOQpPM6lP5sEYEm4qar2P0kIdunrrdDakTtcwuIKCkjtN97_GS7kd&src-supplier=Texas+Instruments; ComponentLink2Description: https://octopart.com:443/opatz8j6/c1?t=SSdhDRwUEWccND8BYLrNj5wD1DjtHCJGpPp5qL4eDQ_gKDkqciQPO5ZgVlRSX3tJETDLPepYZu7qB-RWFbr__4iawFYiX1x0f3L0zYoZy4CUlTc3azSR3e1lnSN8-jfdVdH1s6CMhBb3JPIXtzs8hm8jvaRxQoLGESKQubNtZgDwPXHZ0ZsYo1Ep0h1d3sd73Ka2YfZZK1yMAljyxNHUS4SSJhdwFE68WOjR8hdkuIs9zH66t5n-H9ix6Idip7XAYAIlOq6p1bYOe5C17hXZrhV6jUGn-XkOCR2RMWOIjiP4mcxejeseXVJw8OcjsJNqLjLvba7cbmD2d5NfNFgZRpXJOQpPM6lP5sEYEm4qar2P0kIdunrrdDakTtcwuIKCkjtN97_GS7kd&src-supplier=Texas+Instruments; ComponentLink3URL: https://sigma.octopart.com:443/183468693/technical_drawing/Texas-Instruments-CSD19534Q5A.pdf?src-supplier=Texas+Instruments; ComponentLink3Description: https://sigma.octopart.com:443/183468693/technical_drawing/Texas-Instruments-CSD19534Q5A.pdf?src-supplier=Texas+Instruments; ComponentLink4URL: https://datasheet.octopart.com:443/CSD19534Q5A-Texas-Instruments-datasheet-37708650.pdf?src-supplier=Texas+Instruments; ComponentLink4Description: https://datasheet.octopart.com:443/CSD19534Q5A-Texas-Instruments-datasheet-37708650.pdf?src-supplier=Texas+Instruments; ComponentLink5URL: https://datasheet.octopart.com:443/CSD19534Q5A-Texas-Instruments-datasheet-26524818.pdf?src-supplier=Texas+Instruments; ComponentLink5Description: https://datasheet.octopart.com:443/CSD19534Q5A-Texas-Instruments-datasheet-26524818.pdf?src-supplier=Texas+Instruments; ComponentLink6URL: https://datasheet.octopart.com:443/CSD19534Q5A-Texas-Instruments-datasheet-164413853.pdf?src-supplier=Augswan; ComponentLink6Description: https://datasheet.octopart.com:443/CSD19534Q5A-Texas-Instruments-datasheet-164413853.pdf?src-supplier=Augswan; ComponentLink7URL: https://datasheet.octopart.com:443/CSD19534Q5A-Texas-Instruments-datasheet-159114918.pdf?src-supplier=LCSC; ComponentLink7Description: https://datasheet.octopart.com:443/CSD19534Q5A-Texas-Instruments-datasheet-159114918.pdf?src-supplier=LCSC; ComponentLink8URL: https://datasheet.octopart.com:443/CSD19534Q5A-Texas-Instruments-datasheet-142266150.pdf?src-supplier=Arrow.cn; ComponentLink8Description: https://datasheet.octopart.com:443/CSD19534Q5A-Texas-Instruments-datasheet-142266150.pdf?src-supplier=Arrow.cn; ComponentLink9URL: http://sigma.octopart.com:80/reach_statement/Texas-Instruments-company-64.pdf?src-supplier=Compliance+Statements; ComponentLink9Description: http://sigma.octopart.com:80/reach_statement/Texas-Instruments-company-64.pdf?src-supplier=Compliance+Statements; ComponentLink10URL: http://sigma.octopart.com:80/conflict_mineral_statement/Texas-Instruments-company-63.pdf?src-supplier=Compliance+Statements; ComponentLink10Description: http://sigma.octopart.com:80/conflict_mineral_statement/Texas-Instruments-company-63.pdf?src-supplier=Compliance+Statements